# Altium schematic sheet MCU_peripheral.SchDoc
size A; SheetNumber: 4; SheetTotal: 13
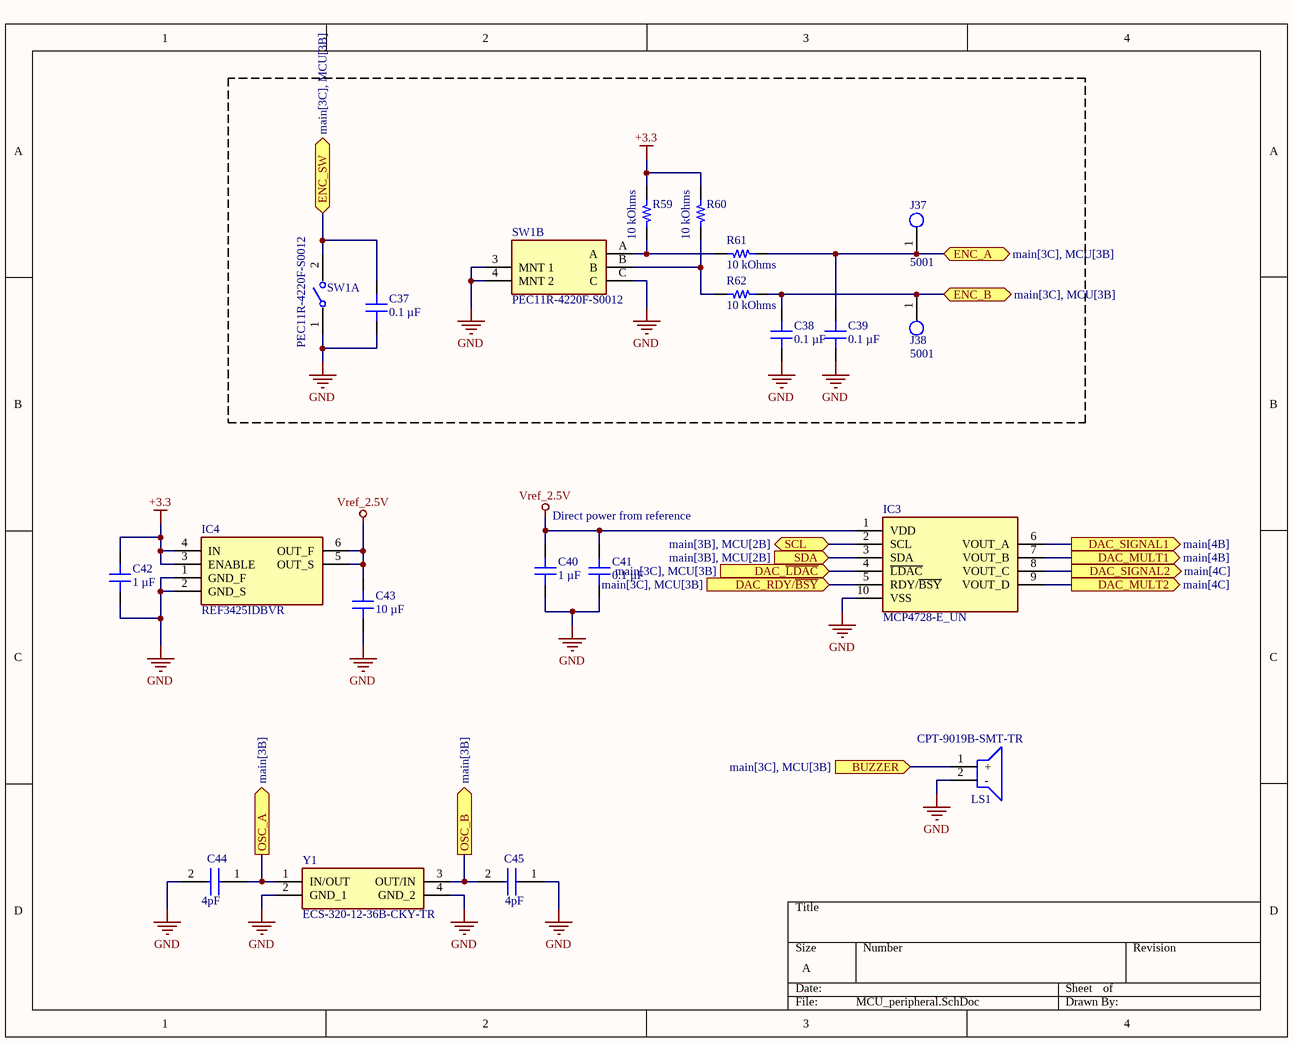
[diagram p0: MCU_peripheral.SchDoc]

## Parts
C37  0.1 µF  [CAP 1206_3216 - 0.8MM]
C38  0.1 µF  [CAP 1206_3216 - 0.8MM]
C39  0.1 µF  [CAP 1206_3216 - 0.8MM]
C40  1 µF  [CAP 1206_3216 - 0.8MM]
C41  0.1 µF  [CAP 1206_3216 - 0.8MM]
C42  1 µF  [CAP 1206_3216 - 0.8MM]
C43  10 µF  [CAP 1206_3216 - 0.8MM]
C44  4pF  [CAPC1608X80N]
C45  4pF  [CAPC1608X80N]
IC3  MCP4728-E_UN  [SOP50P490X110-10N]
IC4  REF3425IDBVR  [SOT95P280X145-6N]
J37  5001  [FP-5001-MFG]
J38  5001  [FP-5001-MFG]
LS1  CPT-9019B-SMT-TR  [CPT9019BSMTTR]
R59  10 kOhms  [YAGEO RES 1206_3216]
R60  10 kOhms  [YAGEO RES 1206_3216]
R61  10 kOhms  [YAGEO RES 1206_3216]
R62  10 kOhms  [YAGEO RES 1206_3216]
SW1  PEC11R-4220F-S0012  [FP-PEC11R-4220F-S0012-MFG]  (parts A,B of 2)
Y1  ECS-320-12-36B-CKY-TR  [ECS240836QAESTR]

## Ports
BUZZER (in, see main[3C], MCU[3B]), DAC_MULT1 (out, see main[4B]), DAC_MULT2 (out, see main[4C]), DAC_RDY/~{BSY} (in, see main[3C], MCU[3B]), DAC_SIGNAL1 (out, see main[4B]), DAC_SIGNAL2 (out, see main[4C]), DAC_~{LDAC} (in, see main[3C], MCU[3B]), ENC_A (bidir, see main[3C], MCU[3B]), ENC_B (bidir, see main[3C], MCU[3B]), ENC_SW (bidir, see main[3C], MCU[3B]), OSC_A (out, see main[3B]), OSC_B (out, see main[3B]), SCL (bidir, see main[3B], MCU[2B]), SDA (in, see main[3B], MCU[2B])

## Nets
+3.3: C42.2 IC4.3(ENABLE) IC4.4(IN) R59.1 R60.1
GND: C37.1 C38.1 C39.1 C40.1 C41.1 C42.1 C43.1 C44.2 C45.1 IC3.10(VSS) IC4.1(GND_F) IC4.2(GND_S) LS1.2(-) SW1.1 SW1.3(MNT_1) SW1.4(MNT_2) SW1.C Y1.2(GND_1) Y1.4(GND_2)
Vref_2.5V: C40.2 C41.2 C43.2 IC3.1(VDD) IC4.5(OUT_S) IC4.6(OUT_F)
BUZZER: LS1.1(+) ; port BUZZER
DAC_~{LDAC}: IC3.4(~{LDAC}) ; port DAC_~{LDAC}
DAC_MULT1: IC3.7(VOUT_B) ; port DAC_MULT1
DAC_MULT2: IC3.9(VOUT_D) ; port DAC_MULT2
DAC_RDY/~{BSY}: IC3.5(RDY/~{BSY}) ; port DAC_RDY/~{BSY}
DAC_SIGNAL1: IC3.6(VOUT_A) ; port DAC_SIGNAL1
DAC_SIGNAL2: IC3.8(VOUT_C) ; port DAC_SIGNAL2
ENC_A: C39.2 J37.1 R61.2 ; port ENC_A
ENC_B: C38.2 J38.1 R62.2 ; port ENC_B
ENC_SW: C37.2 SW1.2 ; port ENC_SW
OSC_A: C44.1 Y1.1(IN/OUT) ; port OSC_A
OSC_B: C45.2 Y1.3(OUT/IN) ; port OSC_B
SCL: IC3.2(SCL) ; port SCL
SDA: IC3.3(SDA) ; port SDA
NetR59_2: R59.2 R61.1 SW1.A
NetR60_2: R60.2 R62.1 SW1.B

## Notes on the sheet
- Direct power from reference

## Library data of the parts
C37-C39 C41 = 885012208087: CAP CER 0.1UF 50V X7R 1206; manufacturer: Würth Elektronik; Tolerance: ±10%; Part Number: 885012208087; Capacitance: 0.1 µF; Applications: General Purpose; componentlink1description: Datasheet; componentlink1url: https://katalog.we-online.de/pbs/datasheet/885012208087.pdf; componentlink2description: DigiKey Link; componentlink2url: https://www.digikey.com/en/products/detail/würth-elektronik/885012208087/5453982; Device Package: 1206 (3216 Metric); lastupdated: 6/4/2024 19:10:27; Lifecycle Status: Active; Minimum Order: 1; Mounting Type: Surface Mount, MLCC; Operating Temperature: -55°C ~ 125°C; Package / Case: 1206 (3216 Metric); packaging: TapeAndReel; partid: 20879; Part Status: Active; price: 0.06; series: WCAP-CSGP; Size / Dimension: 0.126" L x 0.063" W (3.20mm x 1.60mm); Supplier 1: DigiKey; Supplier Part Number 1: 732-8127-1-ND; Temperature Coefficient: X7R; Thickness (Max): 0.035" (0.90mm); value: 0.1 µF; Voltage - Rated: 50V
C40 C42 = 885012208093: CAP CER 1UF 50V X7R 1206; manufacturer: Würth Elektronik; Tolerance: ±10%; Part Number: 885012208093; Capacitance: 1 µF; Applications: General Purpose; componentlink1description: Datasheet; componentlink1url: https://katalog.we-online.de/pbs/datasheet/885012208093.pdf; componentlink2description: DigiKey Link; componentlink2url: https://www.digikey.com/en/products/detail/würth-elektronik/885012208093/5453432; Device Package: 1206 (3216 Metric); lastupdated: 6/4/2024 19:10:33; Lifecycle Status: Active; Minimum Order: 1; Mounting Type: Surface Mount, MLCC; Operating Temperature: -55°C ~ 125°C; Package / Case: 1206 (3216 Metric); packaging: TapeAndReel; partid: 39665; Part Status: Active; price: 0.10; series: WCAP-CSGP; Size / Dimension: 0.126" L x 0.063" W (3.20mm x 1.60mm); Supplier 1: DigiKey; Supplier Part Number 1: 732-7577-1-ND; Temperature Coefficient: X7R; Thickness (Max): 0.075" (1.90mm); value: 1 µF; Voltage - Rated: 50V
C43 = 885012208069: CAP CER 10UF 25V X7R 1206; manufacturer: Würth Elektronik; Tolerance: ±10%; Part Number: 885012208069; Capacitance: 10 µF; Applications: General Purpose; componentlink1description: Datasheet; componentlink1url: https://katalog.we-online.de/pbs/datasheet/885012208069.pdf; componentlink2description: DigiKey Link; componentlink2url: https://www.digikey.com/en/products/detail/würth-elektronik/885012208069/5453429; Device Package: 1206 (3216 Metric); lastupdated: 6/4/2024 19:10:32; Lifecycle Status: Active; Minimum Order: 1; Mounting Type: Surface Mount, MLCC; Operating Temperature: -55°C ~ 125°C; Package / Case: 1206 (3216 Metric); packaging: TapeAndReel; partid: 43199; Part Status: Active; price: 0.40; series: WCAP-CSGP; Size / Dimension: 0.126" L x 0.063" W (3.20mm x 1.60mm); Supplier 1: DigiKey; Supplier Part Number 1: 732-7574-1-ND; Temperature Coefficient: X7R; Thickness (Max): 0.075" (1.90mm); value: 10 µF; Voltage - Rated: 25V
C44 C45 = C1608C0G1H040C080AA: Capacitor; Manufacturer_Name: TDK; Datasheet Link: https://product.tdk.com/info/en/catalog/datasheets/mlcc_commercial_midvoltage_en.pdf; Height: 0.8mm; Manufacturer_Part_Number: C1608C0G1H040C080AA; Arrow Part Number: C1608C0G1H040C080AA; Arrow Price/Stock: https://www.arrow.com/en/products/c1608c0g1h040c080aa/tdk
IC3 = MCP4728-E_UN: Integrated Circuit; Manufacturer_Name: Microchip; Manufacturer_Part_Number: MCP4728-E/UN; Datasheet Link: http://ww1.microchip.com/downloads/en/DeviceDoc/22187E.pdf; Height: 1.1mm; Mouser Part Number: 579-MCP4728-E/UN; Mouser Price/Stock: https://www.mouser.co.uk/ProductDetail/Microchip-Technology/MCP4728-E-UN?qs=E6wAi2XWqcP2zTenScklGA%3D%3D; Arrow Part Number: MCP4728-E/UN; Arrow Price/Stock: https://www.arrow.com/en/products/mcp4728-eun/microchip-technology?utm_currency=USD&region=nac
IC4 = REF3425IDBVR: Integrated Circuit; Manufacturer_Name: Texas Instruments; Datasheet Link: http://www.ti.com/lit/ds/symlink/ref3425.pdf; Height: 1.45mm; Manufacturer_Part_Number: REF3425IDBVR; Mouser Part Number: 595-REF3425IDBVR; Mouser Price/Stock: https://www.mouser.co.uk/ProductDetail/Texas-Instruments/REF3425IDBVR?qs=YCa%2FAAYMW01YJo5s3bO8wA%3D%3D; Arrow Part Number: REF3425IDBVR; Arrow Price/Stock: https://www.arrow.com/en/products/ref3425idbvr/texas-instruments?region=nac
J37 J38 = CMP-2000-05181-2: PC TEST POINT MINIATURE BLACK; Body Material: Bronze; Plating: Silver; Inside Diameter: 1.27mm; Hole Diameter: 1.6mm; Number of Ports: 1; Outside Diameter: 2.54mm; Insulation: Insulated; Insulation Material: Nylon; Mount: Through Hole; RoHS Compliant: Yes; Series: THM; Height: 0.3inch; Termination: Through Hole; Material: Nylon; Packaging: Bulk; Contact Material: Bronze; REACH SVHC: No SVHC; Contact Plating: Silver; Orientation: Straight; Lead Free: Lead Free; Package Quantity: 100; Length: 7.62mm; Flammability Rating: UL94 V-0; Number of Contacts: 1; Diameter: 2.54mm; Housing Color: Black; Color: Black
LS1 = CPT-9019B-SMT-TR: Loudspeaker or Buzzer; Manufacturer_Name: Same Sky; Datasheet Link: https://www.sameskydevices.com/product/resource/supplyframepdf/cpt-9019b-smt-tr.pdf; Height: 2.1mm; Manufacturer_Part_Number: CPT-9019B-SMT-TR; Mouser Part Number: 179-CPT-9019B-SMT-TR; Mouser Price/Stock: https://www.mouser.co.uk/ProductDetail/CUI-Devices/CPT-9019B-SMT-TR?qs=3Rah4i%252BhyCGQOzp5C27TLw%3D%3D
R59-R62 = RT1206FRE0710KL: RES SMD 10K OHM 1% 1/4W 1206; Manufacturer: Yageo; Power (Watts): 0.25W, 1/4W; Temperature Coefficient: ±50ppm/°C; Part Number: RT1206FRE0710KL; ComponentLink1Description: Datasheet; ComponentLink1URL: https://www.yageo.com/upload/media/product/productsearch/datasheet/rchip/PYu-RT_1-to-0.01_RoHS_L_11.pdf; ComponentLink2Description: DigiKey Link; ComponentLink2URL: https://www.digikey.com/en/products/detail/yageo/RT1206FRE0710KL/1082868; Composition: Thin Film; Device Package: 1206 (3216 Metric); Height - Seated (Max): 0.026" (0.65mm); LastUpdated: 7/25/2024 09:21:28; Lifecycle Status: Active; Minimum Order: 1; Number of Terminations: 2; Operating Temperature: -55°C ~ 155°C; Package / Case: 1206 (3216 Metric); Packaging: TapeAndReel; PartId: 38903; Part Status: Active; Price: 0.01; Resistance: 10 kOhms; Series: RT; Size / Dimension: 0.122" L x 0.063" W (3.10mm x 1.60mm); Supplier 1: DigiKey; Supplier Part Number 1: YAG1242CT-ND; Supplier Device Package: 1206; Tolerance: ±1%; Value: 10 kOhms
SW1 = PEC11R-4220F-S0012: ROTARY ENCODER MECHANICAL 12PPR; Built in Switch: Yes; Number of Channels: 2; Output Type: Quadrature; Hole Diameter: 7mm; Pulses per Revolution: 12; Termination: PC Pin; Package Quantity: 150; RoHS Compliant: Yes; Mount: Through Hole; Width: 12.5mm; Radiation Hardening: No; Number of Pins: 5; REACH SVHC: No SVHC; Type: Mechanical; Packaging: Bulk; Min Operating Temperature: -30°C; Encoder Type: Mechanical; Height: 13.4mm; Length: 26.5mm; Orientation: Vertical; Max Operating Temperature: 70°C; Series: PEC11R; Detent: Yes
Y1 = ECS-320-12-36B-CKY-TR: Crystal or Oscillator; Manufacturer_Name: ECS; Datasheet Link: https://www.ecsxtal.com/store/pdf/ECX-2236B.pdf; Height: 0mm; Manufacturer_Part_Number: ECS-320-12-36B-CKY-TR; Mouser Part Number: 520-320-12-36B-CKYT; Mouser Price/Stock: https://www.mouser.co.uk/ProductDetail/ECS/ECS-320-12-36B-CKY-TR?qs=l7cgNqFNU1juKISosFzRbg%3D%3D; Arrow Part Number: ECS-320-12-36B-CKY-TR; Arrow Price/Stock: https://www.arrow.com/en/products/ecs-320-12-36b-cky-tr/ecs-international